# EAGLE design extenstion-board (EAGLE 7.6.0)
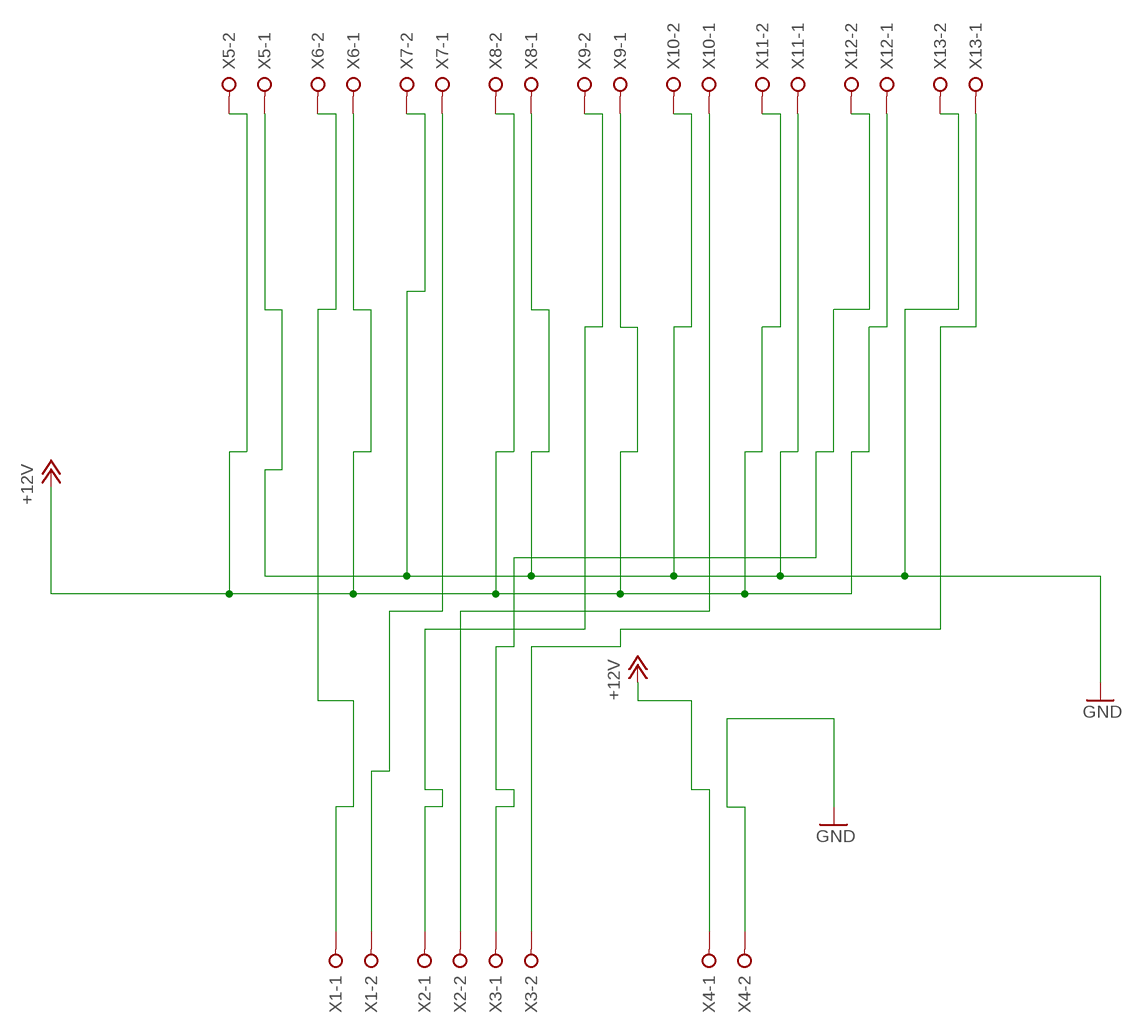
[diagram p0: schematic, sheet 1]

## Parts
X1  W237-02P  [W237-132]
X2  W237-02P  [W237-132]
X3  W237-02P  [W237-132]
X4  W237-02P  [W237-132]
X5  W237-02P  [W237-132]
X6  W237-02P  [W237-132]
X7  W237-02P  [W237-132]
X8  W237-02P  [W237-132]
X9  W237-02P  [W237-132]
X10  W237-02P  [W237-132]
X11  W237-02P  [W237-132]
X12  W237-02P  [W237-132]
X13  W237-02P  [W237-132]

## Nets
+12V: X4.1 X5.2 X6.1 X8.2 X9.1 X11.2 X12.1
GND: X4.2 X5.1 X7.2 X8.1 X10.2 X11.1 X13.2
N$1: X3.1 X12.2
N$2: X1.1 X6.2
N$3: X1.2 X7.1
N$4: X2.1 X9.2
N$5: X2.2 X10.1
N$6: X3.2 X13.1

## Library data of the parts
X1-X13 = pluggable-con:W237-02P: WAGO SREW CLAMP; OC_FARNELL: unknown; OC_NEWARK: unknown

## Board
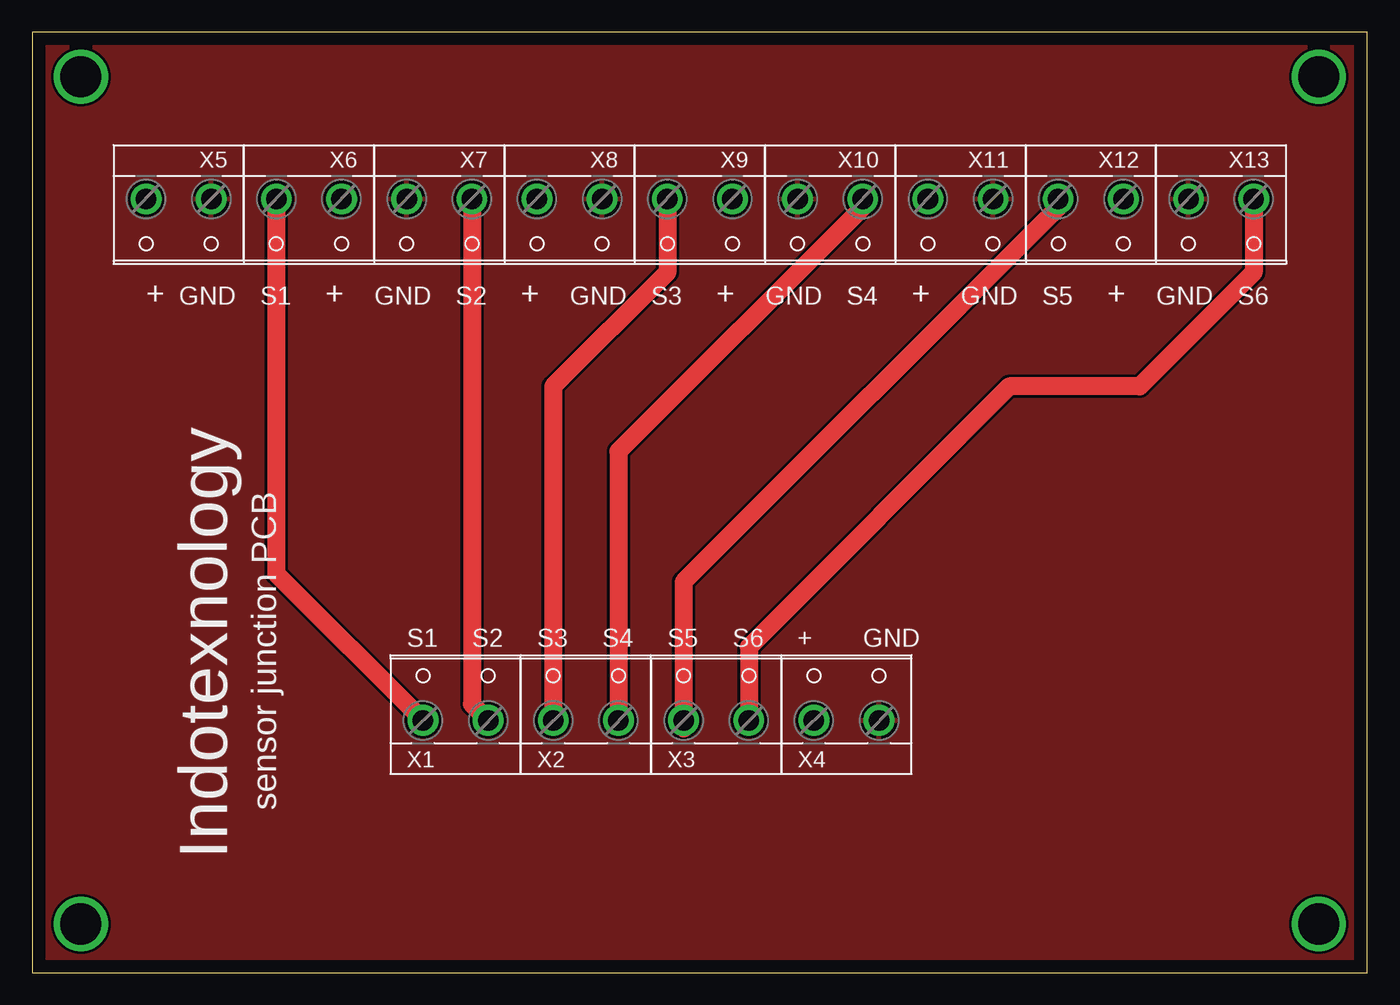
[diagram p1: board, top side]
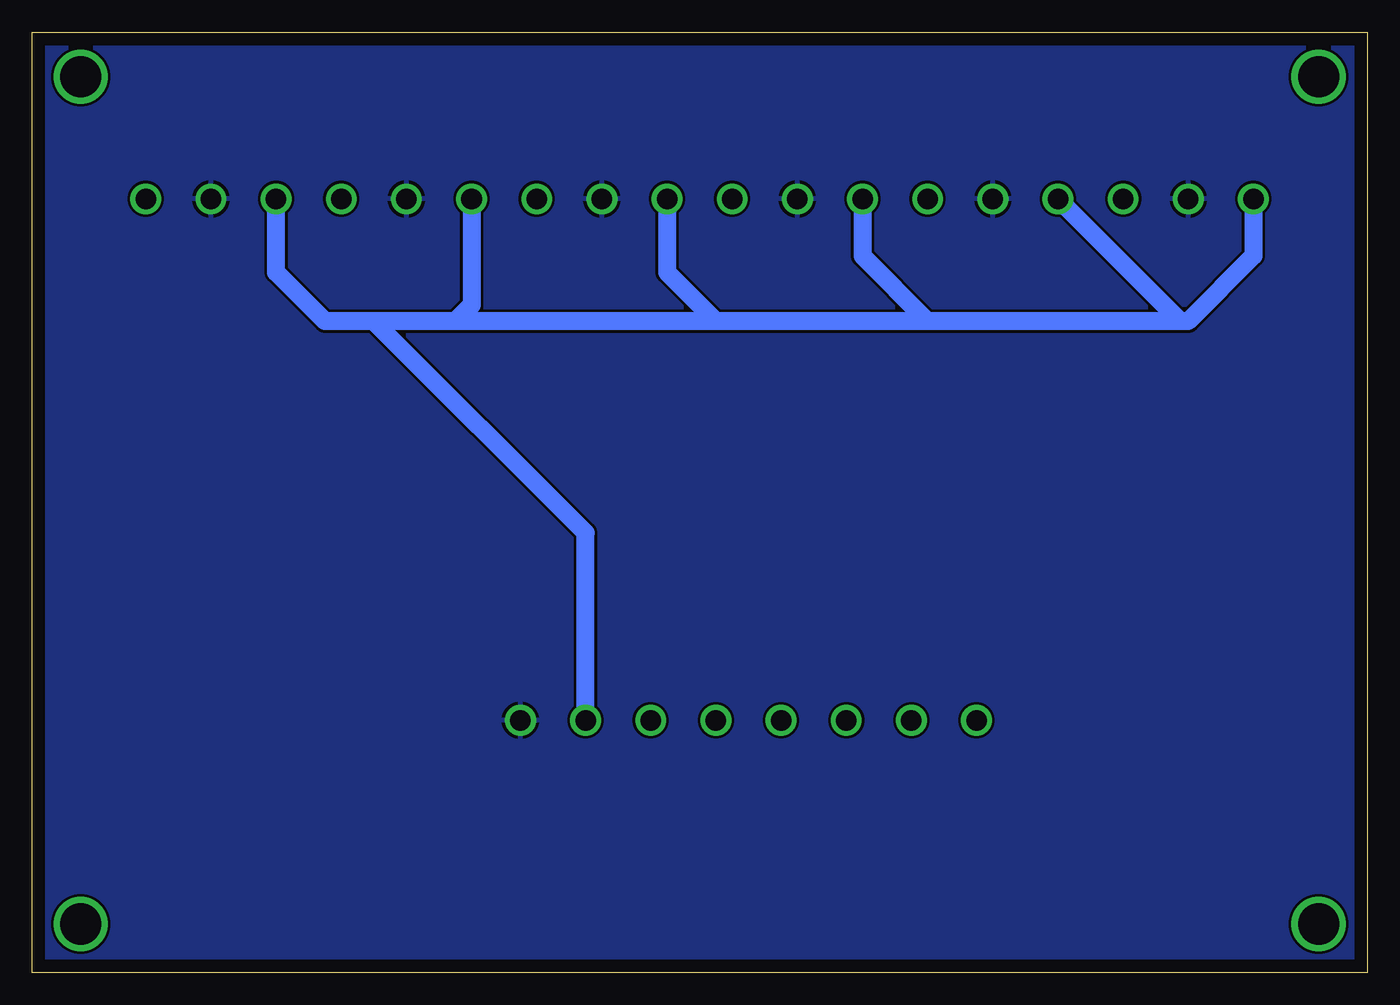
[diagram p2: board, bottom side, seen from below]

Size 104.12 x 73.33 mm. Coordinates in mm from the lower left corner, seen from the top.
Outline: 0,0 104.12,0 104.12,73.33 0,73.33 0,0
Copper layers (1*16): Top 0.035mm / dielectric 1.5mm / Bottom 0.035mm
Design rules "default": minimum track width 10mil, minimum drill 24mil, track to track 8mil, track to pad 8mil, pad to pad 8mil, via to via 8mil, smd to smd 8mil, copper to edge 40mil, drill to drill 8mil, minimum pad ring 10mil, minimum via ring 8mil, stop-mask expansion 4mil, vias tented up to drill 0mil, thermal gap 10mil

### Footprints (pad centres in the part's own frame; a part is rotated, then mirrored left to right if it is on the bottom)
W237-132 = drill 1.6: 1 -2.54,-0.635; 2 2.54,-0.635

### Placement (x,y rotation side)
X1  33.02,20.32 0 top
X2  43.18,20.32 0 top
X3  53.34,20.32 0 top
X4  63.5,20.32 0 top
X5  11.43,59.69 180 top
X6  21.59,59.69 180 top
X7  31.75,59.69 180 top
X8  41.91,59.69 180 top
X9  52.07,59.69 180 top
X10  62.23,59.69 180 top
X11  72.39,59.69 180 top
X12  82.55,59.69 180 top
X13  92.71,59.69 180 top

### Tracks (layer width: path | path; a pad name or v marks a point on that pad's centre or on a via)
+12V
  Bottom 1.422: X5.2 8.89,55.88 13.97,50.8 14.61,50.8 | 14.61,50.8 34.29,50.8 | 34.29,50.8 50.8,50.8 | 50.8,50.8 71.12,50.8 | 71.12,50.8 77.47,50.8 | 77.47,50.8 81.28,50.8 85.09,54.61 X12.1 | 14.61,50.8 X6.1 | X8.2 39.37,55.88 34.29,50.8 | X9.1 54.61,54.61 50.8,50.8 | X11.2 69.85,52.07 71.12,50.8 | X4.1 60.96,34.29 77.47,50.8
GND
  pour Top: 0,73.66 0,0 104.14,0 104.14,73.66
  pour Bottom: 0,73.66 0,0 104.14,0 104.14,73.66
N$1
  Top 1.422: X12.2 80.01,59.69 50.8,30.48 X3.1 50.8,19.05
N$2
  Top 1.422: X6.2 19.05,31.11 X1.1
N$3
  Top 1.422: X7.1 34.29,20.95 X1.2
N$4
  Top 1.422: X9.2 49.53,54.61 40.64,45.72 X2.1
N$5
  Top 1.422: X10.1 64.77,59.69 45.72,40.64 X2.2
N$6
  Top 1.422: X13.1 95.25,54.61 86.36,45.72 76.2,45.72 55.88,25.4 X3.2
N$7  (via drill 3.2)
  other vias: 3.81,69.85
N$8  (via drill 3.2)
  other vias: 100.33,69.85
N$9  (via drill 3.2)
  other vias: 100.33,3.81
N$10  (via drill 3.2)
  other vias: 3.81,3.81

### Text on the board
tNames: + | GND | S1 | + | GND | S2 | + | GND | S3 | + | GND | S4 | + | GND | S5 | + | GND | S6 | S1 | S2 | S3 | S4 | S5 | S6 | + | GND | sensor junction PCB | Indotexnology